# Altium schematic sheet Integrated_Main_Driver_Board 1.5.SchDoc
size A4; SheetNumber: 1; SheetTotal: 7
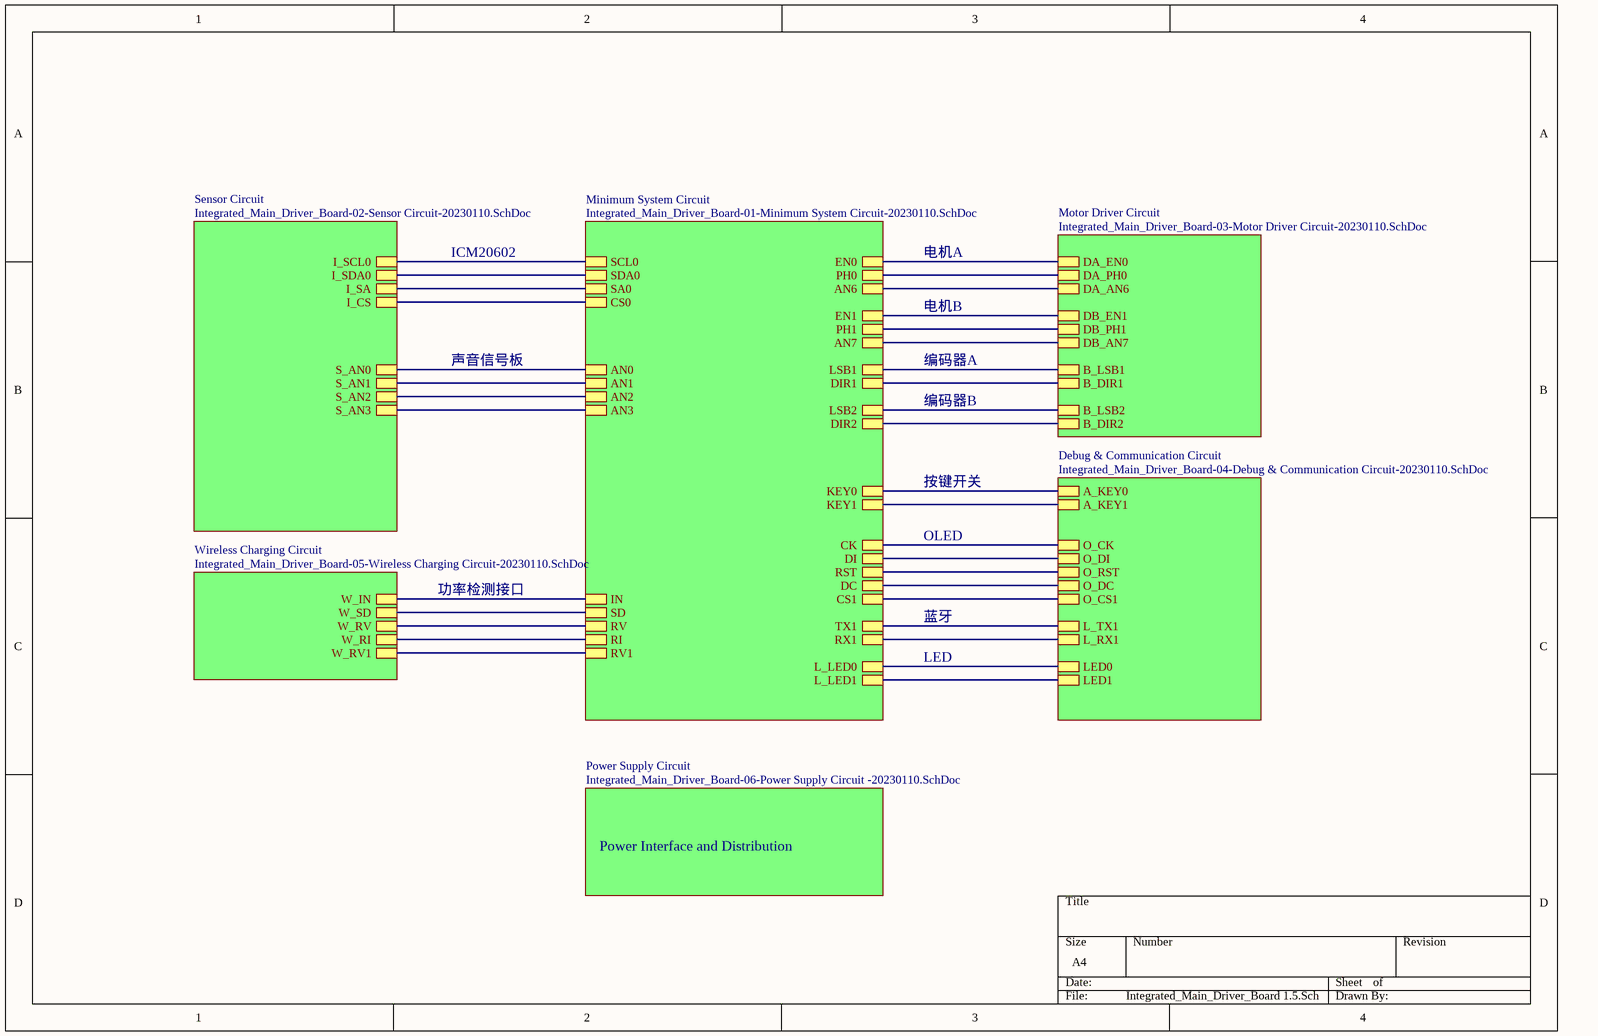
[diagram p0: Integrated_Main_Driver_Board 1.5.SchDoc]

## Sub-sheets
Debug & Communication Circuit = Integrated_Main_Driver_Board-04-Debug & Communication Circuit-20230110.SchDoc: A_KEY0, A_KEY1, O_CK, O_DI, O_RST, O_DC, O_CS1, L_TX1, L_RX1, LED0, LED1
Minimum System Circuit = Integrated_Main_Driver_Board-01-Minimum System Circuit-20230110.SchDoc: SCL0, SDA0, SA0, CS0, LSB1, LSB2, DIR1, DIR2, AN0, AN1, AN2, AN3, KEY0, KEY1, CK, DI, RST, DC, CS1, EN0, EN1, PH0, PH1, AN6, AN7, IN, SD, RV, RI, RV1, TX1, RX1, L_LED0, L_LED1
Motor Driver Circuit = Integrated_Main_Driver_Board-03-Motor Driver Circuit-20230110.SchDoc: DA_EN0, DA_PH0, DB_EN1, DB_PH1, DA_AN6, DB_AN7, B_LSB1, B_LSB2, B_DIR1, B_DIR2
Power Supply Circuit = Integrated_Main_Driver_Board-06-Power Supply Circuit -20230110.SchDoc: no entries
Sensor Circuit = Integrated_Main_Driver_Board-02-Sensor Circuit-20230110.SchDoc: I_CS, I_SA, I_SDA0, I_SCL0, S_AN0, S_AN1, S_AN2, S_AN3
Wireless Charging Circuit = Integrated_Main_Driver_Board-05-Wireless Charging Circuit-20230110.SchDoc: W_IN, W_SD, W_RV, W_RI, W_RV1

## Nets
(unnamed): sheet Minimum System Circuit/SCL0, sheet Sensor Circuit/I_SCL0
(unnamed): sheet Minimum System Circuit/SDA0, sheet Sensor Circuit/I_SDA0
(unnamed): sheet Minimum System Circuit/SA0, sheet Sensor Circuit/I_SA
(unnamed): sheet Minimum System Circuit/CS0, sheet Sensor Circuit/I_CS
(unnamed): sheet Minimum System Circuit/LSB1, sheet Motor Driver Circuit/B_LSB1
(unnamed): sheet Minimum System Circuit/LSB2, sheet Motor Driver Circuit/B_LSB2
(unnamed): sheet Minimum System Circuit/DIR1, sheet Motor Driver Circuit/B_DIR1
(unnamed): sheet Minimum System Circuit/DIR2, sheet Motor Driver Circuit/B_DIR2
(unnamed): sheet Minimum System Circuit/AN0, sheet Sensor Circuit/S_AN0
(unnamed): sheet Minimum System Circuit/AN1, sheet Sensor Circuit/S_AN1
(unnamed): sheet Minimum System Circuit/AN2, sheet Sensor Circuit/S_AN2
(unnamed): sheet Minimum System Circuit/AN3, sheet Sensor Circuit/S_AN3
(unnamed): sheet Minimum System Circuit/KEY0, sheet Debug & Communication Circuit/A_KEY0
(unnamed): sheet Minimum System Circuit/KEY1, sheet Debug & Communication Circuit/A_KEY1
(unnamed): sheet Minimum System Circuit/CK, sheet Debug & Communication Circuit/O_CK
(unnamed): sheet Minimum System Circuit/DI, sheet Debug & Communication Circuit/O_DI
(unnamed): sheet Minimum System Circuit/RST, sheet Debug & Communication Circuit/O_RST
(unnamed): sheet Minimum System Circuit/DC, sheet Debug & Communication Circuit/O_DC
(unnamed): sheet Minimum System Circuit/CS1, sheet Debug & Communication Circuit/O_CS1
(unnamed): sheet Minimum System Circuit/EN0, sheet Motor Driver Circuit/DA_EN0
(unnamed): sheet Minimum System Circuit/EN1, sheet Motor Driver Circuit/DB_EN1
(unnamed): sheet Minimum System Circuit/PH0, sheet Motor Driver Circuit/DA_PH0
(unnamed): sheet Minimum System Circuit/PH1, sheet Motor Driver Circuit/DB_PH1
(unnamed): sheet Minimum System Circuit/AN6, sheet Motor Driver Circuit/DA_AN6
(unnamed): sheet Minimum System Circuit/AN7, sheet Motor Driver Circuit/DB_AN7
(unnamed): sheet Minimum System Circuit/IN, sheet Wireless Charging Circuit/W_IN
(unnamed): sheet Minimum System Circuit/SD, sheet Wireless Charging Circuit/W_SD
(unnamed): sheet Minimum System Circuit/RV, sheet Wireless Charging Circuit/W_RV
(unnamed): sheet Minimum System Circuit/RI, sheet Wireless Charging Circuit/W_RI
(unnamed): sheet Minimum System Circuit/RV1, sheet Wireless Charging Circuit/W_RV1
(unnamed): sheet Minimum System Circuit/TX1, sheet Debug & Communication Circuit/L_TX1
(unnamed): sheet Minimum System Circuit/RX1, sheet Debug & Communication Circuit/L_RX1
(unnamed): sheet Minimum System Circuit/L_LED0, sheet Debug & Communication Circuit/LED0
(unnamed): sheet Minimum System Circuit/L_LED1, sheet Debug & Communication Circuit/LED1

## Notes on the sheet
- ICM20602
- 电机A
- 电机B
- 声音信号板
- 编码器A
- 编码器B
- 按键开关
- OLED
- 功率检测接口
- 蓝牙
- LED
- Power Interface and Distribution